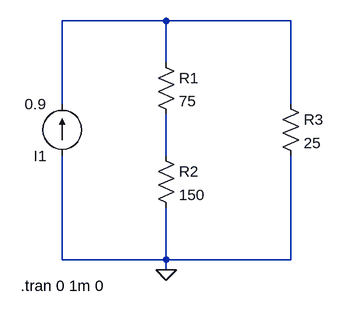
[diagram p0: schematic схемаТест.asc]
схемаТест.asc, the LTspice schematic file:
Version 4.1
SHEET 1 880 680
WIRE 304 16 144 16
WIRE 496 16 304 16
WIRE 304 80 304 16
WIRE 144 144 144 16
WIRE 496 144 496 16
WIRE 304 224 304 160
WIRE 144 384 144 224
WIRE 304 384 304 304
WIRE 304 384 144 384
WIRE 496 384 496 224
WIRE 496 384 304 384
WIRE 304 400 304 384
FLAG 304 400 0
SYMBOL current 144 224 R180
WINDOW 123 0 0 Left 0
WINDOW 39 0 0 Left 0
SYMATTR InstName I1
SYMATTR Value 0.9
SYMBOL res 288 64 R0
SYMATTR InstName R1
SYMATTR Value 75
SYMBOL res 288 208 R0
SYMATTR InstName R2
SYMATTR Value 150
SYMBOL res 480 128 R0
SYMATTR InstName R3
SYMATTR Value 25
TEXT 80 424 Left 2 !.tran 0 1m 0

The netlist it stands for:
* схемаТест.asc
I1 0 N001 0.9
R1 N001 N002 75
R2 N002 0 150
R3 N001 0 25
.tran 0 1m 0
.backanno
.end